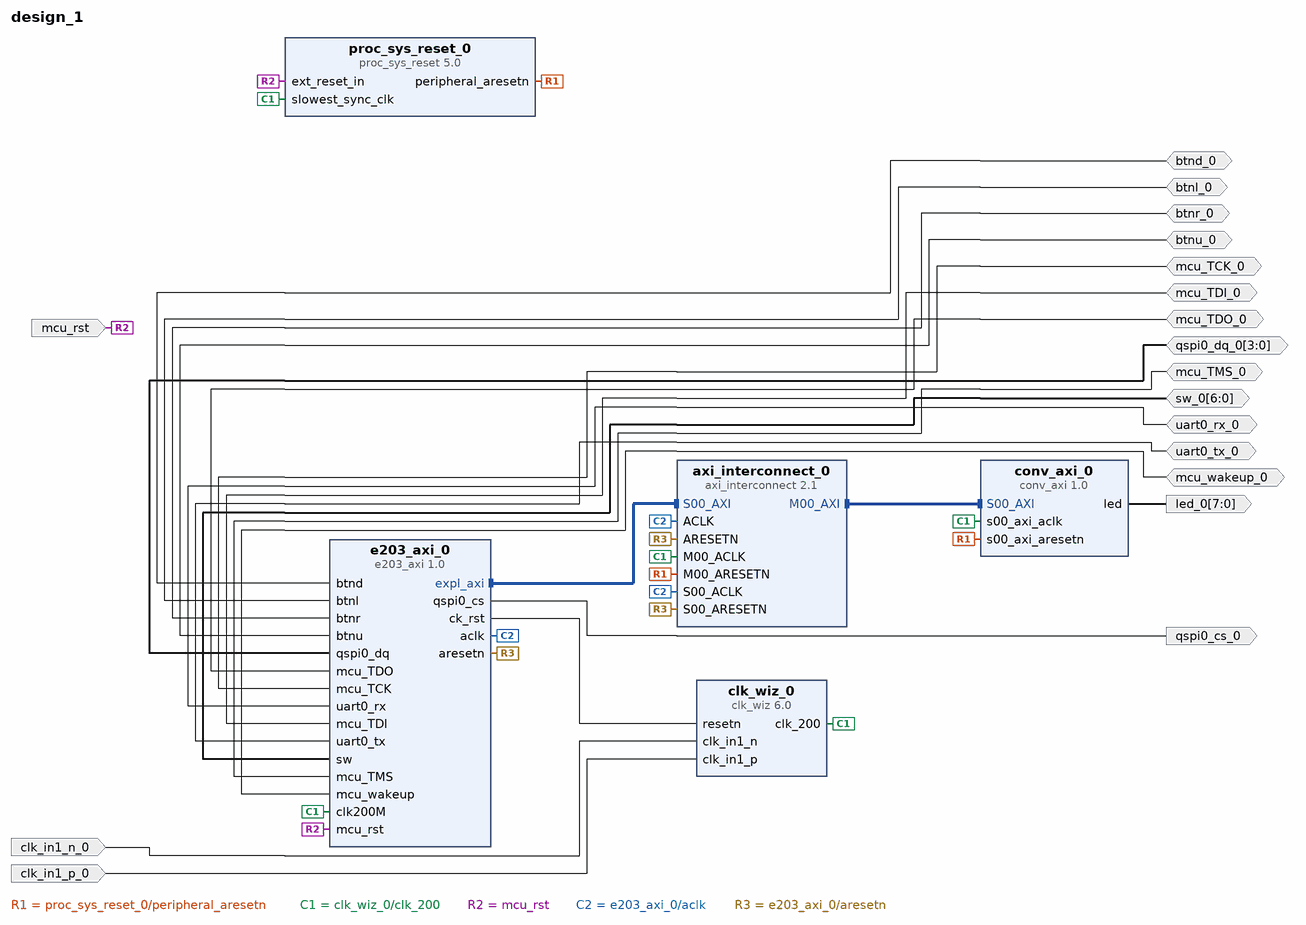
[diagram p0: block diagram of the top level]
# Vivado block design design_1, xc7k325tffg900-2, Vivado 2020.2
create_bd_design design_1

create_bd_port -dir I -type clk clk_in1_n_0
create_bd_port -dir I -type clk clk_in1_p_0
create_bd_port -dir I mcu_rst
create_bd_port -dir IO btnr_0
create_bd_port -dir IO btnl_0
create_bd_port -dir IO -from 3 -to 0 qspi0_dq_0
create_bd_port -dir IO uart0_rx_0
create_bd_port -dir IO btnu_0
create_bd_port -dir IO uart0_tx_0
create_bd_port -dir IO mcu_TCK_0
create_bd_port -dir IO mcu_TDO_0
create_bd_port -dir IO mcu_TMS_0
create_bd_port -dir IO mcu_TDI_0
create_bd_port -dir IO -from 6 -to 0 sw_0
create_bd_port -dir O qspi0_cs_0
create_bd_port -dir IO btnd_0
create_bd_port -dir IO mcu_wakeup_0
create_bd_port -dir O -from 7 -to 0 led_0

create_bd_cell -type ip -vlnv xilinx.com:ip:clk_wiz:6.0 clk_wiz_0
set_property -dict [list \
  CONFIG.CLKIN1_JITTER_PS 50.0 \
  CONFIG.CLKOUT1_JITTER 98.146 \
  CONFIG.CLKOUT1_PHASE_ERROR 89.971 \
  CONFIG.CLKOUT1_REQUESTED_OUT_FREQ 200.000 \
  CONFIG.CLKOUT2_JITTER 112.316 \
  CONFIG.CLKOUT2_PHASE_ERROR 89.971 \
  CONFIG.CLKOUT2_USED true \
  CONFIG.CLK_IN1_BOARD_INTERFACE sys_diff_clock \
  CONFIG.CLK_OUT1_PORT clk_200 \
  CONFIG.CLK_OUT2_PORT clk_100 \
  CONFIG.MMCM_CLKFBOUT_MULT_F 5.000 \
  CONFIG.MMCM_CLKIN1_PERIOD 5.000 \
  CONFIG.MMCM_CLKIN2_PERIOD 10.0 \
  CONFIG.MMCM_CLKOUT0_DIVIDE_F 5.000 \
  CONFIG.MMCM_CLKOUT1_DIVIDE 10 \
  CONFIG.NUM_OUT_CLKS 2 \
  CONFIG.PRIM_SOURCE Differential_clock_capable_pin \
  CONFIG.RESET_PORT resetn \
  CONFIG.RESET_TYPE ACTIVE_LOW \
] [get_bd_cells clk_wiz_0]
create_bd_cell -type ip -vlnv xilinx.com:ip:axi_interconnect:2.1 axi_interconnect_0
set_property -dict {CONFIG.NUM_MI 1} [get_bd_cells axi_interconnect_0]
create_bd_cell -type ip -vlnv xilinx.com:ip:proc_sys_reset:5.0 proc_sys_reset_0
create_bd_cell -type ip -vlnv xilinx.com:user:e203_axi:1.0 e203_axi_0
create_bd_cell -type ip -vlnv xilinx.com:user:conv_axi:1.0 conv_axi_0

# ---- connections ----

connect_bd_intf_net [get_bd_intf_pins e203_axi_0/expl_axi] [get_bd_intf_pins axi_interconnect_0/S00_AXI]
connect_bd_intf_net [get_bd_intf_pins conv_axi_0/S00_AXI] [get_bd_intf_pins axi_interconnect_0/M00_AXI]
connect_bd_net [get_bd_pins proc_sys_reset_0/peripheral_aresetn] [get_bd_pins axi_interconnect_0/M00_ARESETN] [get_bd_pins conv_axi_0/s00_axi_aresetn]
connect_bd_net [get_bd_pins clk_wiz_0/clk_200] \
  [get_bd_pins axi_interconnect_0/M00_ACLK] [get_bd_pins proc_sys_reset_0/slowest_sync_clk] [get_bd_pins e203_axi_0/clk200M] \
  [get_bd_pins conv_axi_0/s00_axi_aclk]
connect_bd_net -net clk_in1_n_0_1 [get_bd_ports clk_in1_n_0] [get_bd_pins clk_wiz_0/clk_in1_n]
connect_bd_net -net clk_in1_p_0_1 [get_bd_ports clk_in1_p_0] [get_bd_pins clk_wiz_0/clk_in1_p]
connect_bd_net [get_bd_ports mcu_rst] [get_bd_pins proc_sys_reset_0/ext_reset_in] [get_bd_pins e203_axi_0/mcu_rst]
connect_bd_net -net system_0_aclk [get_bd_pins e203_axi_0/aclk] [get_bd_pins axi_interconnect_0/ACLK] [get_bd_pins axi_interconnect_0/S00_ACLK]
connect_bd_net -net system_0_aresetn [get_bd_pins e203_axi_0/aresetn] \
  [get_bd_pins axi_interconnect_0/ARESETN] [get_bd_pins axi_interconnect_0/S00_ARESETN]
connect_bd_net [get_bd_pins e203_axi_0/qspi0_cs] [get_bd_ports qspi0_cs_0]
connect_bd_net [get_bd_ports qspi0_dq_0] [get_bd_pins e203_axi_0/qspi0_dq]
connect_bd_net [get_bd_ports btnd_0] [get_bd_pins e203_axi_0/btnd]
connect_bd_net [get_bd_ports btnl_0] [get_bd_pins e203_axi_0/btnl]
connect_bd_net [get_bd_ports btnr_0] [get_bd_pins e203_axi_0/btnr]
connect_bd_net [get_bd_ports btnu_0] [get_bd_pins e203_axi_0/btnu]
connect_bd_net [get_bd_ports uart0_rx_0] [get_bd_pins e203_axi_0/uart0_rx]
connect_bd_net [get_bd_ports uart0_tx_0] [get_bd_pins e203_axi_0/uart0_tx]
connect_bd_net [get_bd_ports sw_0] [get_bd_pins e203_axi_0/sw]
connect_bd_net [get_bd_ports mcu_TDO_0] [get_bd_pins e203_axi_0/mcu_TDO]
connect_bd_net [get_bd_ports mcu_TCK_0] [get_bd_pins e203_axi_0/mcu_TCK]
connect_bd_net [get_bd_ports mcu_TDI_0] [get_bd_pins e203_axi_0/mcu_TDI]
connect_bd_net [get_bd_ports mcu_TMS_0] [get_bd_pins e203_axi_0/mcu_TMS]
connect_bd_net [get_bd_pins e203_axi_0/ck_rst] [get_bd_pins clk_wiz_0/resetn]
connect_bd_net [get_bd_ports mcu_wakeup_0] [get_bd_pins e203_axi_0/mcu_wakeup]
connect_bd_net [get_bd_pins conv_axi_0/led] [get_bd_ports led_0]

# ---- address map ----
assign_bd_address -offset 0x40000000 -range 64K -target_address_space [get_bd_addr_spaces e203_axi_0/expl_axi] [get_bd_addr_segs conv_axi_0/S00_AXI/S00_AXI_reg]

validate_bd_design
save_bd_design
